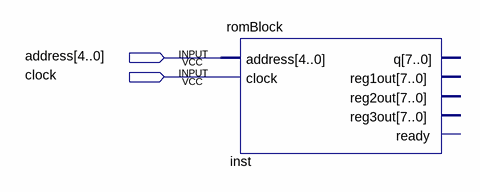
[diagram p0: schematic sheet]
// Quartus schematic Block2.bdf as structural Verilog: 1 symbols, 2 pins
module Block2 (
  input  [4:0] address,
  input  clock
);

  romBlock inst (.address(address), .clock(clock));  // open: q, reg1out, reg2out, reg3out, ready
endmodule
